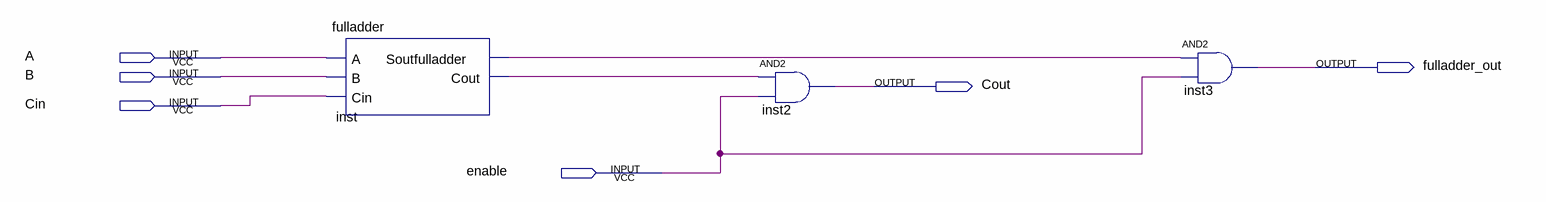
[diagram p0: schematic sheet]
// Quartus schematic fulladder_enable.bdf as structural Verilog: 3 symbols, 6 pins
module fulladder_enable (
  input  A,
  input  B,
  input  Cin,
  input  enable,
  output fulladder_out,
  output Cout
);

  wire inst_cout, inst_soutfulladder;

  fulladder inst (.A(A), .B(B), .Cin(Cin), .Soutfulladder(inst_soutfulladder), .Cout(inst_cout));
  and inst2 (Cout, inst_cout, enable);
  and inst3 (fulladder_out, inst_soutfulladder, enable);
endmodule
